# EAGLE design musical-wheelchair (EAGLE 7.7.0)
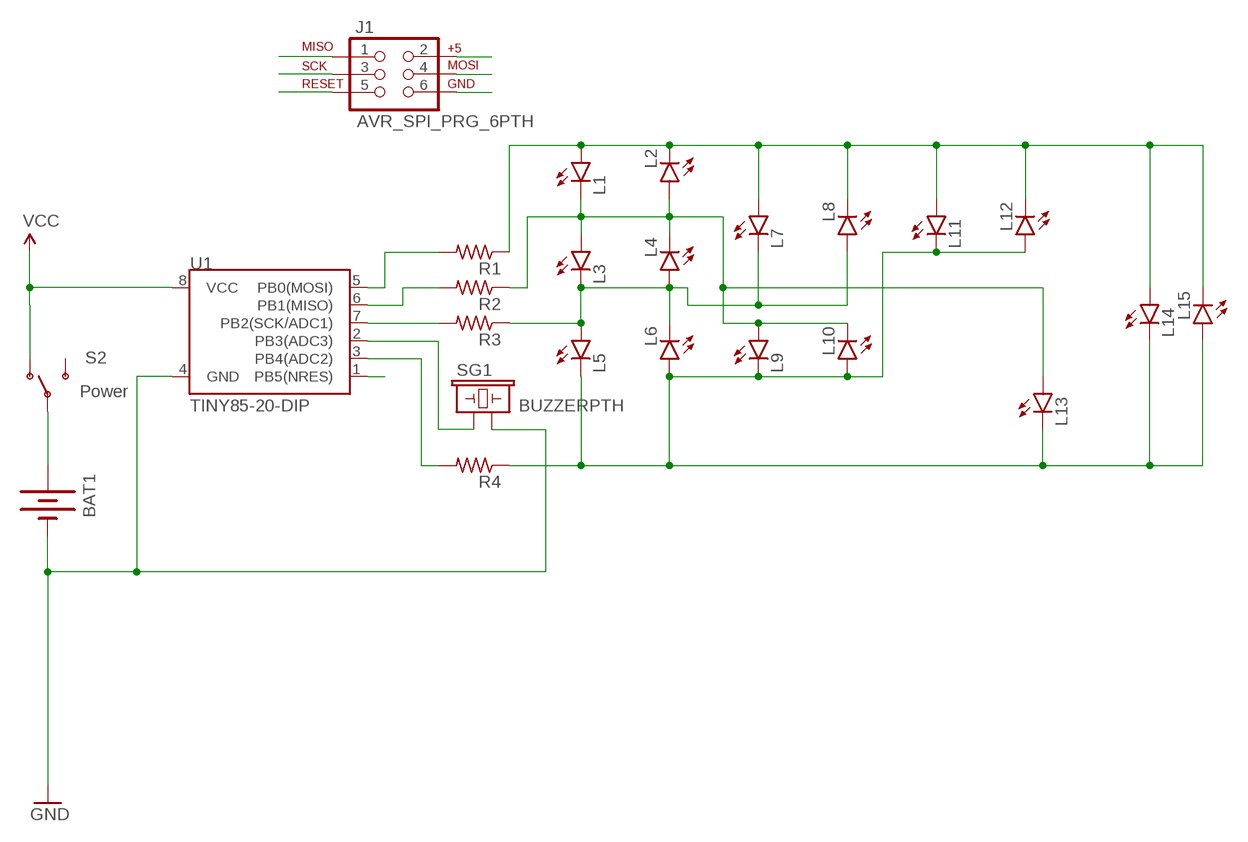
[diagram p0: schematic, sheet 1]

## Parts
BAT1  BATTERY20PTH  [BATTCOM_20MM_PTH]
J1  AVR_SPI_PRG_6PTH  [2X3]
L1  LED5MM  [LED5MM]
L2  LED5MM  [LED5MM]
L3  LED5MM  [LED5MM]
L4  LED5MM  [LED5MM]
L5  LED5MM  [LED5MM]
L6  LED5MM  [LED5MM]
L7  LED5MM  [LED5MM]
L8  LED5MM  [LED5MM]
L9  LED5MM  [LED5MM]
L10  LED5MM  [LED5MM]
L11  LED5MM  [LED5MM]
L12  LED5MM  [LED5MM]
L13  LED5MM  [LED5MM]
L14  LED5MM  [LED5MM]
L15  LED5MM  [LED5MM]
R1  R-US_0204/5  [0204/5]
R2  R-US_0204/5  [0204/5]
R3  R-US_0204/5  [0204/5]
R4  R-US_0204/5  [0204/5]
S2  Power  SWITCH-SPDTPTH  [SWITCH-SPDT]
SG1  BUZZERPTH  [BUZZER-12MM]
U1  TINY85-20-DIP  ATTINY45TINY85-20-DIP  [DIP08]

## Nets
GND: BAT1.2(-) J1.6 SG1.- U1.4(GND)
L12: L1.K(C) L2.A L3.A L4.K(C) L9.A L10.K(C) L13.A R2.1
MISO: J1.1 R2.2 U1.6(PB1(MISO))
MOSI: J1.4 R1.2 U1.5(PB0(MOSI))
N$1: BAT1.1(+) S2.2(P)
N$4: SG1.+ U1.2(PB3(ADC3))
N$5: R4.2 U1.3(PB4(ADC2))
N$6: L1.A L2.K(C) L7.A L8.K(C) L11.A L12.K(C) L14.A L15.K(C) R1.1
N$7: L3.K(C) L4.A L5.A L6.K(C) L7.K(C) L8.A R3.1
N$8: L5.K(C) L6.A L9.K(C) L10.A L11.K(C) L12.A L13.K(C) L14.K(C) L15.A R4.1
RST: J1.5 U1.1(PB5(NRES))
SCK: J1.3 R3.2 U1.7(PB2(SCK/ADC1))
VCC: J1.2 S2.1(O) U1.8(VCC)
Unconnected: S2.3(S)

## Library data of the parts
BAT1 = SparkFun-Electromechanical:BATTERY: Battery Holders Various common sizes : AA, AAA, 20mm coin cell and 12mm coin cell. 20MM_4LEGS, BATT-10373
J1 = SparkFun:AVR_SPI_PRG_6: AVR ISP 6 Pin This is the reduced ISP connector for AVR programming. Common on Arduino. This footprint will take up less PCB space and can be used with a 10-pin to 6-pin adapter such as SKU: BOB-08508
L1-L15 = SparkFun-LED:LED: LEDs Standard schematic elements and footprints for 5mm, 3mm, 1206, and 0603 sized LEDs. 5mm - Spark Fun Electronics SKU : COM-00529 (and others)
R1-R4 = rcl:R-US_: RESISTOR, American symbol
S2 = SparkFun-Electromechanical:SWITCH-SPDT: SPDT Switch Simple slide switch, Spark Fun Electronics SKU : COM-00102 DPDT SMT slide switch, AYZ0202, SWCH-08179
SG1 = SparkFun-Electromechanical:BUZZER: Buzzer 12mm Spark Fun Electronics SKU : Comp-Buzzer
U1 = SparkFun-DigitalIC:ATTINY45: Atmel 8-pin 2/4/8kB flash uC; PROD_ID: IC-09445

## Board
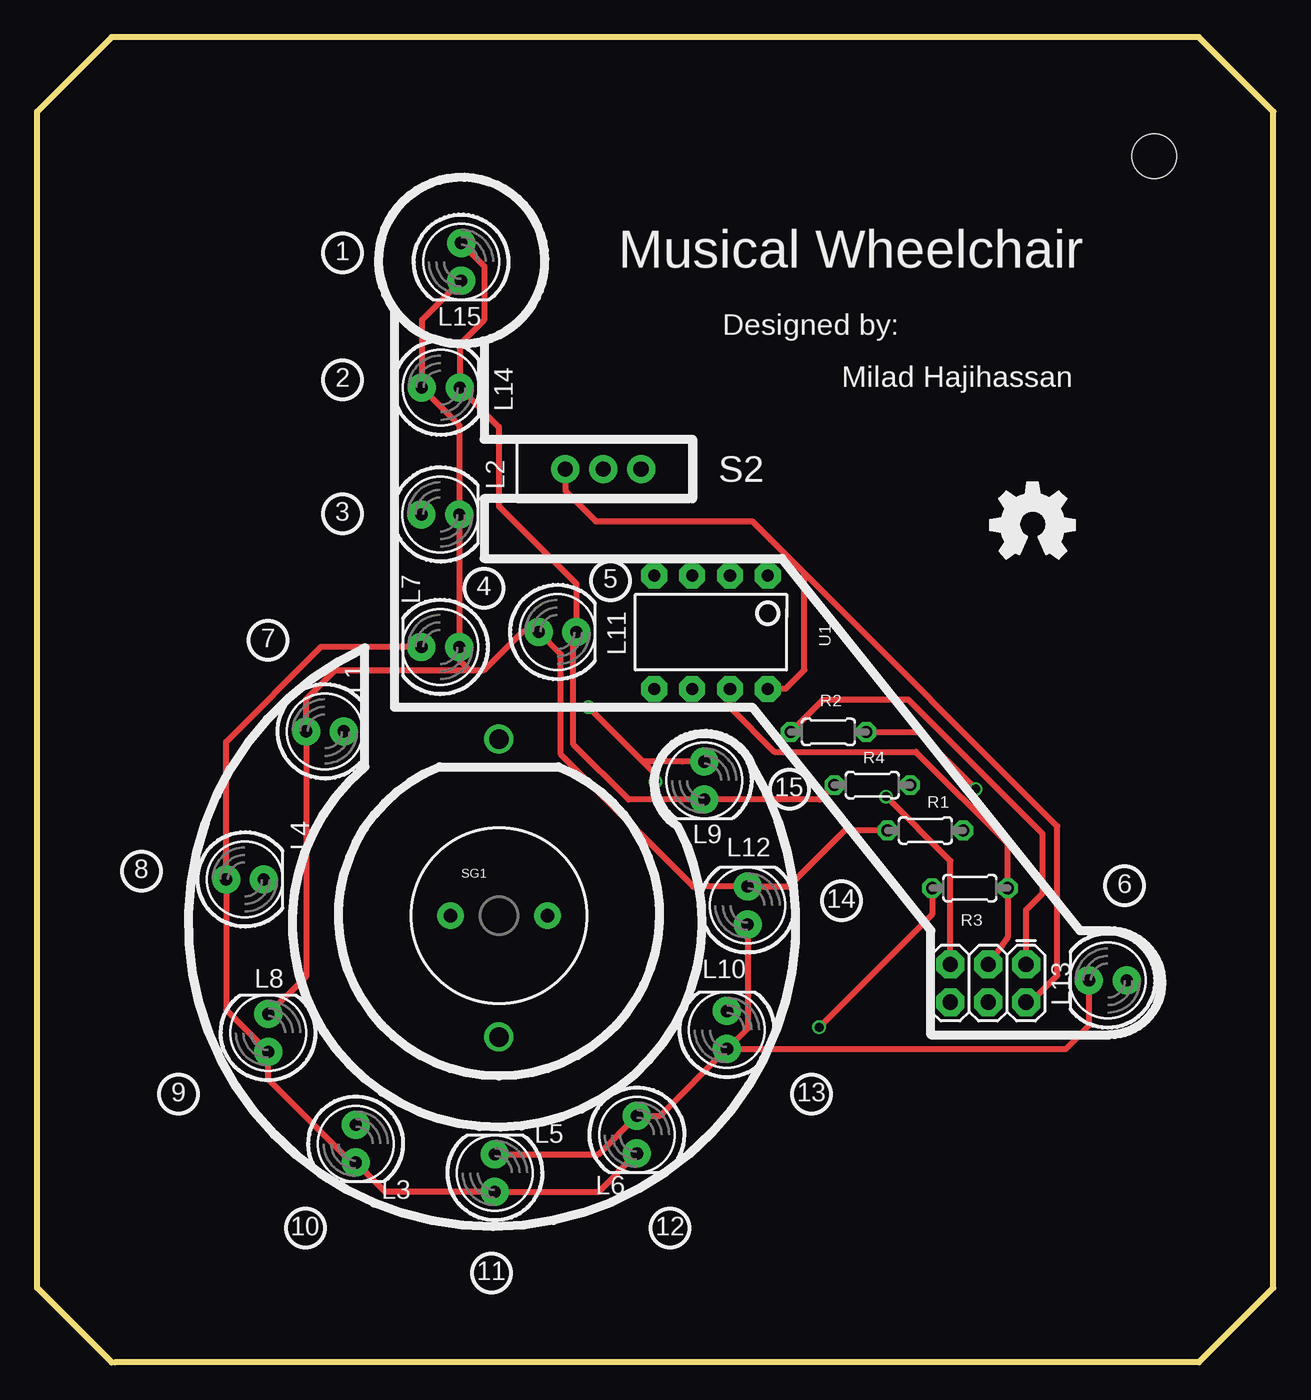
[diagram p1: board, top side]
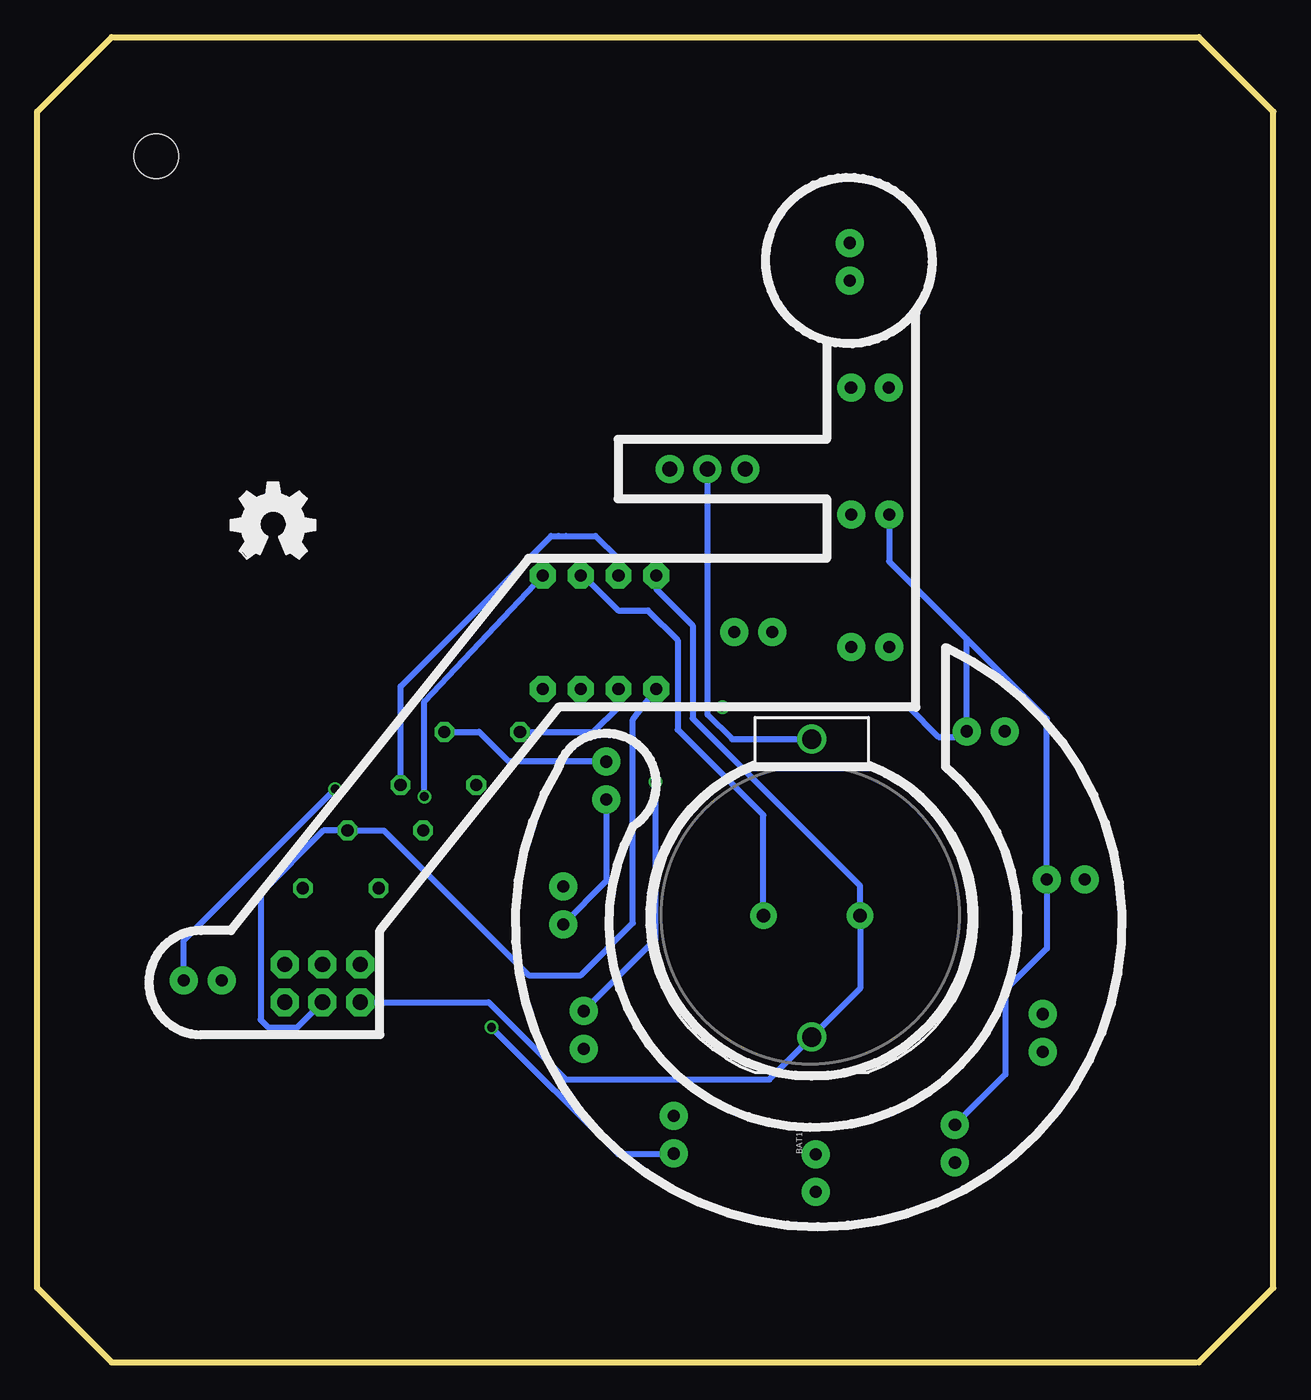
[diagram p2: board, bottom side, seen from below]

Size 83 x 89 mm. Coordinates in mm from the lower left corner, seen from the top.
Outline: 5.21,0 78,0 83,5 83,84 78,89 5,89 0,84 0,5 5,0
Copper layers (1*16): Top 0.035mm / dielectric 1.5mm / Bottom 0.035mm
Design rules "default": minimum track width 6mil, minimum drill 12mil, track to track 6mil, track to pad 6mil, pad to pad 6mil, via to via 6mil, smd to smd 0mil, copper to edge 10mil, drill to drill 10mil, minimum pad ring 10mil, minimum via ring 6mil, stop-mask expansion 2mil, vias tented up to drill 100mil, thermal gap 10mil
Holes 3 mm at 75,81

### Footprints (pad centres in the part's own frame; a part is rotated, then mirrored left to right if it is on the bottom)
BATTCOM_20MM_PTH = drill 1.3: 1 11.85,0; 2 -8.15,0
2X3 = drill 1.016 pad 1.88 octagon: 1 0,0; 2 0,2.54; 3 2.54,0; 4 2.54,2.54; 5 5.08,0; 6 5.08,2.54
LED5MM = drill 0.813 pad 1.88: A -1.27,0; K 1.27,0
0204/5 = drill 0.813 octagon: 1 -2.54,0; 2 2.54,0
SWITCH-SPDT = drill 1.016 pad 1.88: 1 0,2.54; 2 0,0; 3 0,-2.54
BUZZER-12MM = drill 0.9 pad 1.778: + 3.25,0; - -3.25,0
DIP08 = drill 0.813 pad 1.727 octagon: 1 -3.81,-3.81; 2 -1.27,-3.81; 3 1.27,-3.81; 4 3.81,-3.81; 5 3.81,3.81; 6 1.27,3.81; 7 -1.27,3.81; 8 -3.81,3.81

### Placement (x,y rotation side)
BAT1  31,30 90 bottom
J1  66.39,26.73 180 top
L1  19.32,42.38 0 top
L2  27.07,56.95 0 top
L3  21.38,14.68 270 top
L4  13.95,32.43 0 top
L5  30.73,12.71 90 top
L6  40.27,15.29 270 top
L7  27.07,48.05 180 top
L8  15.5,22.11 90 top
L9  44.78,39.07 270 top
L10  46.31,22.32 90 top
L11  34.93,49.05 0 top
L12  47.69,30.68 90 top
L13  71.89,25.64 180 top
L14  27.09,65.46 0 top
L15  28.46,73.91 270 top
R1  59.63,35.72 0 top
R2  53.12,42.34 180 top
R3  62.62,31.84 0 top
R4  56.07,38.77 0 top
S2  38,60 90 top
SG1  31,30 0 top
U1  45.24,49.04 180 top
U$1  [OSHW_FILLX200_NOTEXT]  64,54 0 top
U$2  [OSHW_FILLX200_NOTEXT]  70,54 0 bottom

### Tracks (layer width: path | path; a pad name or v marks a point on that pad's centre or on a via)
GND
  Bottom 0.406: J1.6 52.69,24.19 47.5,19 33.85,19 BAT1.2 27.75,25.1 SG1.- 27.75,32 39,43.25 39,49.5 41.43,51.93 U1.4
L12  (via drill 0.6)
  Top 0.406: R2.1 59.16,42.34 v63,38.5 | 43.34,40.34 L9.A 40.66,40.34 | 40.66,40.34 v37,44 | v41.5,39 41.5,39.5 40.66,40.34
  Bottom 0.406: L3.A 18,19.34 18,25 15.22,27.78 L4.K 15.22,43.22 20.59,48.59 | 20.59,48.59 L1.K 20.97,42 22.5,42 24.5,44 v37,44 | R2.1 53.34,42.34 51.34,40.34 L9.A | v41.5,39 41.5,28.4 L10.K | L2.A 25.8,53.8 20.59,48.59 | L13.A 73.16,28.34 v63,38.5
MISO
  Top 0.406: J1.1 66.39,30.39 67.5,31.5 67.5,35.5 58.5,44.5 52.75,44.5 R2.2
  Bottom 0.406: U1.6 43.97,44.03 45.66,42.34 R2.2
MOSI
  Bottom 0.406: J1.4 65.54,22.5 67.5,22.5 68,23 68,31.5 63.78,35.72 R1.2 59.72,35.72 50,26 46.5,26 43,29.5 43,43.16 U1.5
N$1
  Bottom 0.406: S2.2 38,43.5 36.35,41.85 BAT1.1
N$4
  Bottom 0.406: SG1.+ 34.25,36.75 40,42.5 40,48.5 42,50.5 44,50.5 46.35,52.85 U1.2
N$5
  Bottom 0.406: U1.3 43.97,53.97 45.5,55.5 47.5,55.5 48,55.5 48.5,55.5 58.61,45.39 R4.2
N$6
  Top 0.406: L15.K 25.82,70 L14.A 28.34,62.94 L2.K L7.A 28.34,47.16 29,46.5 | L8.K 18.05,25.93 L1.A 18.05,44.55 20,46.5 29,46.5 | 29,46.5 30,46.5 32.55,49.05 L11.A 35.16,47.55 35.16,40.84 44.05,31.95 L12.K 50.45,31.95 54.22,35.72 R1.1
N$7  (via drill 0.6)
  Top 0.406: L6.K 37.69,11.44 L5.A 23.36,11.44 L3.K 21.09,13.41 15.5,19 L8.A 12.68,23.67 L4.A 12.68,41.68 19.05,48.05 L7.K | R3.1 60.08,30.08 v52.5,22.5
  Bottom 0.406: v52.5,22.5 44,14 40.29,14 L6.K
N$8
  Top 0.406: L15.A 30,73.64 30,70 28.36,68.36 L14.K 31,62.81 31,57.5 36.2,52.3 L11.K 36,48.85 36,41.5 39.7,37.8 L9.K 52.56,37.8 R4.1 | L5.K 37.69,13.98 L6.A 41.82,16.56 L10.A | L10.A 69.05,21.05 70.62,22.62 L13.K | L12.A 47.69,22.43 L10.A
  Bottom 0.406: L9.K 44.78,32.32 L12.A
RST  (via drill 0.6)
  Top 0.406: J1.5 61.31,33.69 v57,38
  Bottom 0.406: v57,38 57,44.4 U1.1
SCK
  Top 0.406: J1.3 65.16,28.54 R3.2 65.16,34.84 59,41 49.5,41 46.5,44 46.5,45.21 U1.7
VCC
  Top 0.406: S2.1 35.46,58.54 37.5,56.5 48,56.5 49.25,55.25 51.5,53 | U1.8 50.23,45.23 51.5,46.5 51.5,53 | J1.2 66.69,24.19 68.5,26 68.5,36 51.5,53

### Text on the board
tPlace: 1 | 2 | 3 | 5 | 4 | 7 | 15 | 8 | 14 | 6 | 9 | 13 | 10 | 12 | 11
tNames: Musical Wheelchair | Designed by: | Milad Hajihassan